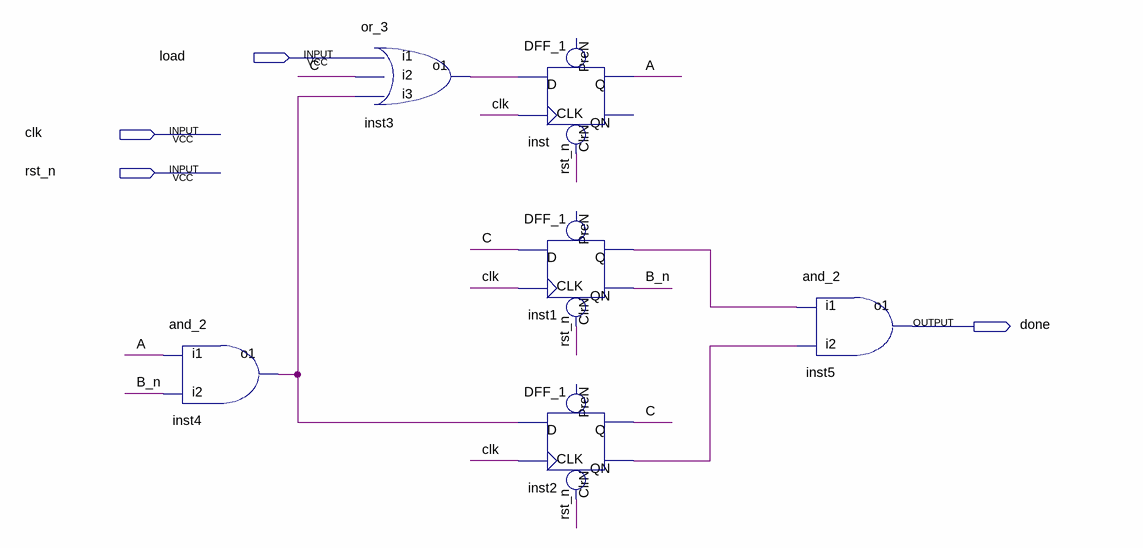
[diagram p0: schematic sheet]
// Quartus schematic Controller.bdf as structural Verilog: 6 symbols, 4 pins
module Controller (
  input  load,
  input  clk,
  input  rst_n,
  output done
);

  wire A, B_n, C, inst1_q, inst2_qn, inst3_o1, inst4_o1;

  and_2 inst4 (.i1(A), .i2(B_n), .o1(inst4_o1));
  or_3 inst3 (.i1(load), .i2(C), .i3(inst4_o1), .o1(inst3_o1));
  DFF_1 inst (.CLK(clk), .D(inst3_o1), .ClrN(rst_n), .Q(A));  // open: PreN, QN
  DFF_1 inst1 (.CLK(clk), .D(C), .ClrN(rst_n), .QN(B_n), .Q(inst1_q));  // open: PreN
  DFF_1 inst2 (.CLK(clk), .D(inst4_o1), .ClrN(rst_n), .QN(inst2_qn), .Q(C));  // open: PreN
  and_2 inst5 (.i1(inst1_q), .i2(inst2_qn), .o1(done));
endmodule
